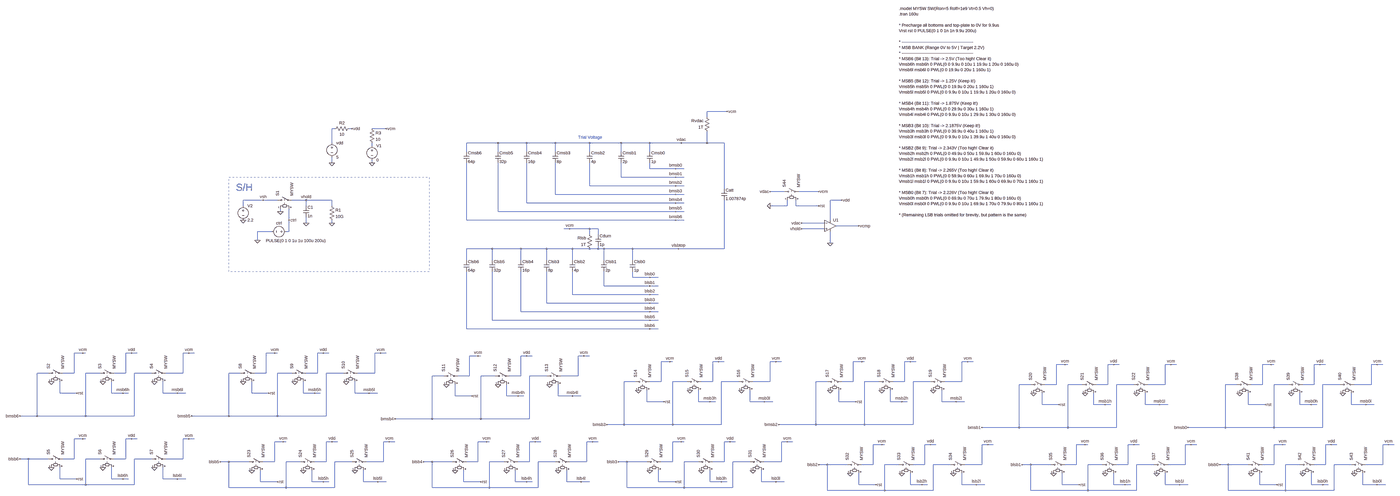
[diagram p0: schematic SAR_ADC_SIM.asc, whole sheet]
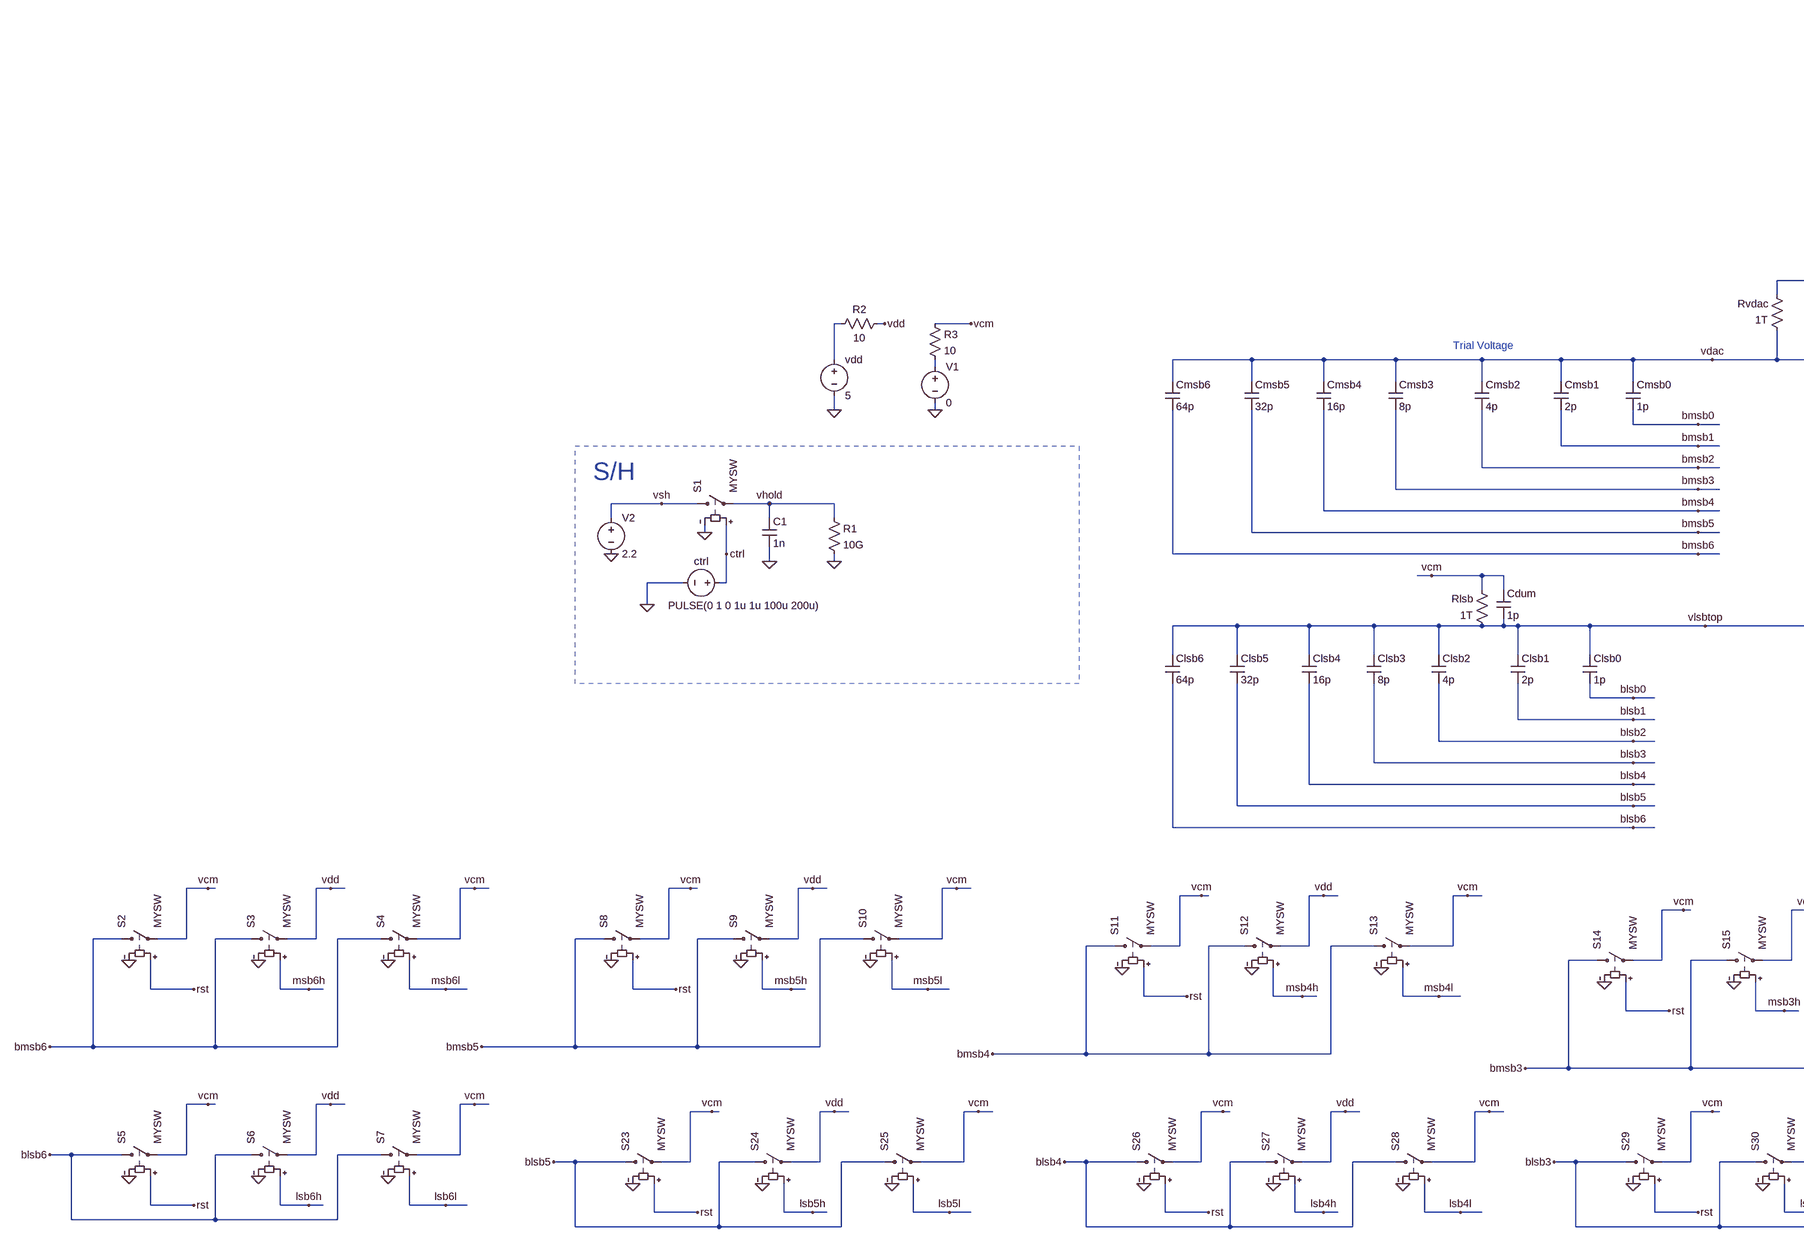
[diagram p1: schematic SAR_ADC_SIM.asc, part, row 1 of 1, column 1 of 2]
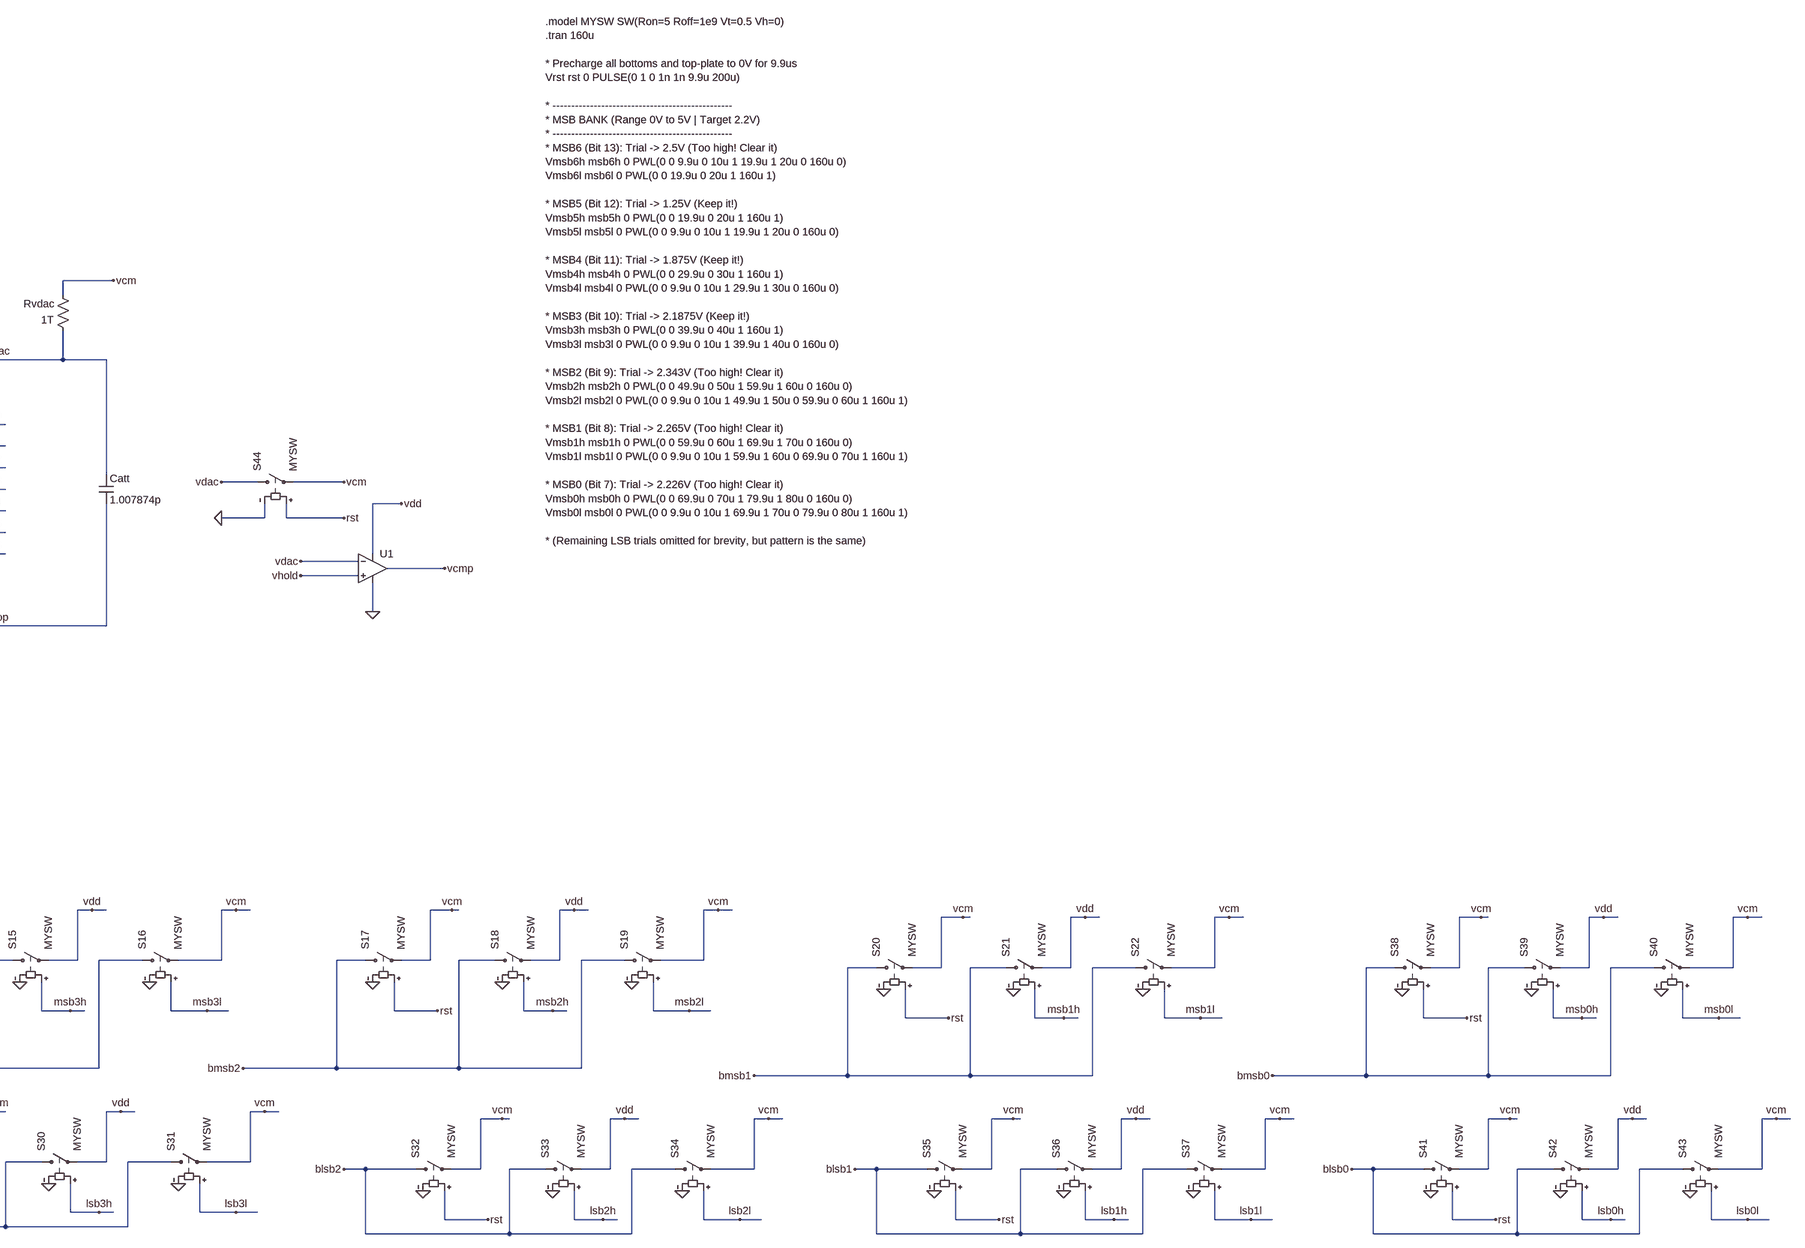
[diagram p2: schematic SAR_ADC_SIM.asc, part, row 1 of 1, column 2 of 2]
SAR_ADC_SIM.asc, the LTspice schematic file:
Version 4.1
SHEET 1 9780 2408
WIRE 2784 -16 2672 -16
WIRE 2672 16 2672 -16
WIRE 592 80 576 80
WIRE 688 80 672 80
WIRE 880 80 800 80
WIRE 576 160 576 80
WIRE 1504 160 1328 160
WIRE 1664 160 1504 160
WIRE 1824 160 1664 160
WIRE 2016 160 1824 160
WIRE 2192 160 2016 160
WIRE 2352 160 2192 160
WIRE 2528 160 2352 160
WIRE 2672 160 2672 96
WIRE 2672 160 2528 160
WIRE 2768 160 2672 160
WIRE 800 176 800 160
WIRE 1328 208 1328 160
WIRE 1504 208 1504 160
WIRE 1664 208 1664 160
WIRE 1824 208 1824 160
WIRE 2016 208 2016 160
WIRE 2192 208 2192 160
WIRE 2352 208 2352 160
WIRE 576 272 576 240
WIRE 800 272 800 256
WIRE 2352 304 2352 272
WIRE 2496 304 2352 304
WIRE 2544 304 2496 304
WIRE 2192 352 2192 272
WIRE 2496 352 2192 352
WIRE 2544 352 2496 352
WIRE 2016 400 2016 272
WIRE 2496 400 2016 400
WIRE 2544 400 2496 400
WIRE 2768 416 2768 160
WIRE 3104 432 3024 432
WIRE 3296 432 3184 432
WIRE 1824 448 1824 272
WIRE 2496 448 1824 448
WIRE 2544 448 2496 448
WIRE 192 480 80 480
WIRE 272 480 192 480
WIRE 432 480 352 480
WIRE 576 480 432 480
WIRE 3424 480 3360 480
WIRE 1664 496 1664 272
WIRE 2496 496 1664 496
WIRE 2544 496 2496 496
WIRE 80 512 80 480
WIRE 432 512 432 480
WIRE 576 512 576 480
WIRE 3120 512 3120 480
WIRE 3120 512 3024 512
WIRE 3168 512 3168 480
WIRE 3296 512 3168 512
WIRE 288 544 288 528
WIRE 1504 544 1504 272
WIRE 2496 544 1504 544
WIRE 2544 544 2496 544
WIRE 336 592 336 528
WIRE 1328 592 1328 272
WIRE 2496 592 1328 592
WIRE 2544 592 2496 592
WIRE 3360 592 3360 480
WIRE 432 608 432 576
WIRE 576 608 576 592
WIRE 3328 608 3200 608
WIRE 3520 624 3392 624
WIRE 1904 640 1872 640
WIRE 2016 640 1904 640
WIRE 2064 640 2016 640
WIRE 3328 640 3200 640
WIRE 240 656 160 656
WIRE 336 656 336 592
WIRE 336 656 320 656
WIRE 2016 672 2016 640
WIRE 2064 672 2064 640
WIRE 160 704 160 656
WIRE 3360 720 3360 656
WIRE 1472 752 1328 752
WIRE 1632 752 1472 752
WIRE 1776 752 1632 752
WIRE 1920 752 1776 752
WIRE 2016 752 1920 752
WIRE 2064 752 2064 736
WIRE 2064 752 2016 752
WIRE 2096 752 2064 752
WIRE 2256 752 2096 752
WIRE 2512 752 2256 752
WIRE 2768 752 2768 480
WIRE 2768 752 2512 752
WIRE 1328 816 1328 752
WIRE 1472 816 1472 752
WIRE 1632 816 1632 752
WIRE 1776 816 1776 752
WIRE 1920 816 1920 752
WIRE 2096 816 2096 752
WIRE 2256 816 2256 752
WIRE 2256 912 2256 880
WIRE 2352 912 2256 912
WIRE 2400 912 2352 912
WIRE 2096 960 2096 880
WIRE 2352 960 2096 960
WIRE 2400 960 2352 960
WIRE 1920 1008 1920 880
WIRE 2352 1008 1920 1008
WIRE 2400 1008 2352 1008
WIRE 1776 1056 1776 880
WIRE 2352 1056 1776 1056
WIRE 2400 1056 2352 1056
WIRE 1632 1104 1632 880
WIRE 2352 1104 1632 1104
WIRE 2400 1104 2352 1104
WIRE 1472 1152 1472 880
WIRE 2352 1152 1472 1152
WIRE 2400 1152 2352 1152
WIRE 1328 1200 1328 880
WIRE 2352 1200 1328 1200
WIRE 2400 1200 2352 1200
WIRE -816 1472 -864 1472
WIRE -800 1472 -816 1472
WIRE -544 1472 -576 1472
WIRE -512 1472 -544 1472
WIRE -224 1472 -256 1472
WIRE -192 1472 -224 1472
WIRE 256 1472 208 1472
WIRE 272 1472 256 1472
WIRE 528 1472 496 1472
WIRE 560 1472 528 1472
WIRE 848 1472 816 1472
WIRE 880 1472 848 1472
WIRE 1392 1488 1344 1488
WIRE 1408 1488 1392 1488
WIRE 1664 1488 1632 1488
WIRE 1696 1488 1664 1488
WIRE 1984 1488 1952 1488
WIRE 2016 1488 1984 1488
WIRE 2464 1520 2416 1520
WIRE 2480 1520 2464 1520
WIRE 2736 1520 2704 1520
WIRE 2768 1520 2736 1520
WIRE 3056 1520 3024 1520
WIRE 3088 1520 3056 1520
WIRE 3536 1520 3488 1520
WIRE 3552 1520 3536 1520
WIRE 3808 1520 3776 1520
WIRE 3840 1520 3808 1520
WIRE 4128 1520 4096 1520
WIRE 4160 1520 4128 1520
WIRE 4672 1536 4624 1536
WIRE 4688 1536 4672 1536
WIRE 4944 1536 4912 1536
WIRE 4976 1536 4944 1536
WIRE 5264 1536 5232 1536
WIRE 5296 1536 5264 1536
WIRE 5824 1536 5776 1536
WIRE 5840 1536 5824 1536
WIRE 6096 1536 6064 1536
WIRE 6128 1536 6096 1536
WIRE 6416 1536 6384 1536
WIRE 6448 1536 6416 1536
WIRE -1008 1584 -1072 1584
WIRE -864 1584 -864 1472
WIRE -864 1584 -928 1584
WIRE -720 1584 -800 1584
WIRE -576 1584 -576 1472
WIRE -576 1584 -640 1584
WIRE -432 1584 -528 1584
WIRE -256 1584 -256 1472
WIRE -256 1584 -352 1584
WIRE 64 1584 0 1584
WIRE 208 1584 208 1472
WIRE 208 1584 144 1584
WIRE 352 1584 272 1584
WIRE 496 1584 496 1472
WIRE 496 1584 432 1584
WIRE 640 1584 544 1584
WIRE 816 1584 816 1472
WIRE 816 1584 720 1584
WIRE 1200 1600 1136 1600
WIRE 1344 1600 1344 1488
WIRE 1344 1600 1280 1600
WIRE 1488 1600 1408 1600
WIRE 1632 1600 1632 1488
WIRE 1632 1600 1568 1600
WIRE 1776 1600 1680 1600
WIRE 1952 1600 1952 1488
WIRE 1952 1600 1856 1600
WIRE 2272 1632 2208 1632
WIRE 2416 1632 2416 1520
WIRE 2416 1632 2352 1632
WIRE 2560 1632 2480 1632
WIRE 2704 1632 2704 1520
WIRE 2704 1632 2640 1632
WIRE 2848 1632 2752 1632
WIRE 3024 1632 3024 1520
WIRE 3024 1632 2928 1632
WIRE 3344 1632 3280 1632
WIRE 3488 1632 3488 1520
WIRE 3488 1632 3424 1632
WIRE 3632 1632 3552 1632
WIRE 3776 1632 3776 1520
WIRE 3776 1632 3712 1632
WIRE 3920 1632 3824 1632
WIRE 4096 1632 4096 1520
WIRE 4096 1632 4000 1632
WIRE 4480 1648 4416 1648
WIRE 4624 1648 4624 1536
WIRE 4624 1648 4560 1648
WIRE 4768 1648 4688 1648
WIRE 4912 1648 4912 1536
WIRE 4912 1648 4848 1648
WIRE 5056 1648 4960 1648
WIRE 5232 1648 5232 1536
WIRE 5232 1648 5136 1648
WIRE 5632 1648 5568 1648
WIRE 5776 1648 5776 1536
WIRE 5776 1648 5712 1648
WIRE 5920 1648 5840 1648
WIRE 6064 1648 6064 1536
WIRE 6064 1648 6000 1648
WIRE 6208 1648 6112 1648
WIRE 6384 1648 6384 1536
WIRE 6384 1648 6288 1648
WIRE -944 1696 -944 1632
WIRE -848 1696 -944 1696
WIRE -656 1696 -656 1632
WIRE -592 1696 -656 1696
WIRE -560 1696 -592 1696
WIRE -368 1696 -368 1632
WIRE -288 1696 -368 1696
WIRE -240 1696 -288 1696
WIRE 128 1696 128 1632
WIRE 224 1696 128 1696
WIRE 416 1696 416 1632
WIRE 480 1696 416 1696
WIRE 512 1696 480 1696
WIRE 704 1696 704 1632
WIRE 784 1696 704 1696
WIRE 832 1696 784 1696
WIRE 1264 1712 1264 1648
WIRE 1360 1712 1264 1712
WIRE 1552 1712 1552 1648
WIRE 1616 1712 1552 1712
WIRE 1648 1712 1616 1712
WIRE 1840 1712 1840 1648
WIRE 1920 1712 1840 1712
WIRE 1968 1712 1920 1712
WIRE 2336 1744 2336 1680
WIRE 2432 1744 2336 1744
WIRE 2624 1744 2624 1680
WIRE 2688 1744 2624 1744
WIRE 2720 1744 2688 1744
WIRE 2912 1744 2912 1680
WIRE 2992 1744 2912 1744
WIRE 3040 1744 2992 1744
WIRE 3408 1744 3408 1680
WIRE 3504 1744 3408 1744
WIRE 3696 1744 3696 1680
WIRE 3760 1744 3696 1744
WIRE 3792 1744 3760 1744
WIRE 3984 1744 3984 1680
WIRE 4064 1744 3984 1744
WIRE 4112 1744 4064 1744
WIRE 4544 1760 4544 1696
WIRE 4640 1760 4544 1760
WIRE 4832 1760 4832 1696
WIRE 4896 1760 4832 1760
WIRE 4928 1760 4896 1760
WIRE 5120 1760 5120 1696
WIRE 5200 1760 5120 1760
WIRE 5248 1760 5200 1760
WIRE 5696 1760 5696 1696
WIRE 5792 1760 5696 1760
WIRE 5984 1760 5984 1696
WIRE 6048 1760 5984 1760
WIRE 6080 1760 6048 1760
WIRE 6272 1760 6272 1696
WIRE 6352 1760 6272 1760
WIRE 6400 1760 6352 1760
WIRE -1072 1824 -1072 1584
WIRE -1072 1824 -1168 1824
WIRE -800 1824 -800 1584
WIRE -800 1824 -1072 1824
WIRE -528 1824 -528 1584
WIRE -528 1824 -800 1824
WIRE 0 1824 0 1584
WIRE 0 1824 -208 1824
WIRE 272 1824 272 1584
WIRE 272 1824 0 1824
WIRE 544 1824 544 1584
WIRE 544 1824 272 1824
WIRE 1136 1840 1136 1600
WIRE 1136 1840 928 1840
WIRE 1408 1840 1408 1600
WIRE 1408 1840 1136 1840
WIRE 1680 1840 1680 1600
WIRE 1680 1840 1408 1840
WIRE 2208 1872 2208 1632
WIRE 2208 1872 2112 1872
WIRE 2480 1872 2480 1632
WIRE 2480 1872 2208 1872
WIRE 2752 1872 2752 1632
WIRE 2752 1872 2480 1872
WIRE 3280 1872 3280 1632
WIRE 3280 1872 3072 1872
WIRE 3552 1872 3552 1632
WIRE 3552 1872 3280 1872
WIRE 3824 1872 3824 1632
WIRE 3824 1872 3552 1872
WIRE 4416 1888 4416 1648
WIRE 4416 1888 4208 1888
WIRE 4688 1888 4688 1648
WIRE 4688 1888 4416 1888
WIRE 4960 1888 4960 1648
WIRE 4960 1888 4688 1888
WIRE 5568 1888 5568 1648
WIRE 5568 1888 5360 1888
WIRE 5840 1888 5840 1648
WIRE 5840 1888 5568 1888
WIRE 6112 1888 6112 1648
WIRE 6112 1888 5840 1888
WIRE -816 1952 -864 1952
WIRE -800 1952 -816 1952
WIRE -544 1952 -576 1952
WIRE -512 1952 -544 1952
WIRE -224 1952 -256 1952
WIRE -192 1952 -224 1952
WIRE 304 1968 256 1968
WIRE 320 1968 304 1968
WIRE 576 1968 544 1968
WIRE 608 1968 576 1968
WIRE 896 1968 864 1968
WIRE 928 1968 896 1968
WIRE 1440 1968 1392 1968
WIRE 1456 1968 1440 1968
WIRE 1712 1968 1680 1968
WIRE 1744 1968 1712 1968
WIRE 2032 1968 2000 1968
WIRE 2064 1968 2032 1968
WIRE 2528 1968 2480 1968
WIRE 2544 1968 2528 1968
WIRE 2800 1968 2768 1968
WIRE 2832 1968 2800 1968
WIRE 3120 1968 3088 1968
WIRE 3152 1968 3120 1968
WIRE 3648 1984 3600 1984
WIRE 3664 1984 3648 1984
WIRE 3920 1984 3888 1984
WIRE 3952 1984 3920 1984
WIRE 4240 1984 4208 1984
WIRE 4272 1984 4240 1984
WIRE 4784 1984 4736 1984
WIRE 4800 1984 4784 1984
WIRE 5056 1984 5024 1984
WIRE 5088 1984 5056 1984
WIRE 5376 1984 5344 1984
WIRE 5408 1984 5376 1984
WIRE 5888 1984 5840 1984
WIRE 5904 1984 5888 1984
WIRE 6160 1984 6128 1984
WIRE 6192 1984 6160 1984
WIRE 6480 1984 6448 1984
WIRE 6512 1984 6480 1984
WIRE -1120 2064 -1168 2064
WIRE -1008 2064 -1120 2064
WIRE -864 2064 -864 1952
WIRE -864 2064 -928 2064
WIRE -720 2064 -800 2064
WIRE -576 2064 -576 1952
WIRE -576 2064 -640 2064
WIRE -432 2064 -528 2064
WIRE -256 2064 -256 1952
WIRE -256 2064 -352 2064
WIRE 0 2080 -48 2080
WIRE 112 2080 0 2080
WIRE 256 2080 256 1968
WIRE 256 2080 192 2080
WIRE 400 2080 320 2080
WIRE 544 2080 544 1968
WIRE 544 2080 480 2080
WIRE 688 2080 592 2080
WIRE 864 2080 864 1968
WIRE 864 2080 768 2080
WIRE 1136 2080 1088 2080
WIRE 1248 2080 1136 2080
WIRE 1392 2080 1392 1968
WIRE 1392 2080 1328 2080
WIRE 1536 2080 1456 2080
WIRE 1680 2080 1680 1968
WIRE 1680 2080 1616 2080
WIRE 1824 2080 1728 2080
WIRE 2000 2080 2000 1968
WIRE 2000 2080 1904 2080
WIRE 2224 2080 2176 2080
WIRE 2336 2080 2224 2080
WIRE 2480 2080 2480 1968
WIRE 2480 2080 2416 2080
WIRE 2624 2080 2544 2080
WIRE 2768 2080 2768 1968
WIRE 2768 2080 2704 2080
WIRE 2912 2080 2816 2080
WIRE 3088 2080 3088 1968
WIRE 3088 2080 2992 2080
WIRE 3344 2096 3296 2096
WIRE 3456 2096 3344 2096
WIRE 3600 2096 3600 1984
WIRE 3600 2096 3536 2096
WIRE 3744 2096 3664 2096
WIRE 3888 2096 3888 1984
WIRE 3888 2096 3824 2096
WIRE 4032 2096 3936 2096
WIRE 4208 2096 4208 1984
WIRE 4208 2096 4112 2096
WIRE 4480 2096 4432 2096
WIRE 4592 2096 4480 2096
WIRE 4736 2096 4736 1984
WIRE 4736 2096 4672 2096
WIRE 4880 2096 4800 2096
WIRE 5024 2096 5024 1984
WIRE 5024 2096 4960 2096
WIRE 5168 2096 5072 2096
WIRE 5344 2096 5344 1984
WIRE 5344 2096 5248 2096
WIRE 5584 2096 5536 2096
WIRE 5696 2096 5584 2096
WIRE 5840 2096 5840 1984
WIRE 5840 2096 5776 2096
WIRE 5984 2096 5904 2096
WIRE 6128 2096 6128 1984
WIRE 6128 2096 6064 2096
WIRE 6272 2096 6176 2096
WIRE 6448 2096 6448 1984
WIRE 6448 2096 6352 2096
WIRE -944 2176 -944 2112
WIRE -848 2176 -944 2176
WIRE -656 2176 -656 2112
WIRE -592 2176 -656 2176
WIRE -560 2176 -592 2176
WIRE -368 2176 -368 2112
WIRE -288 2176 -368 2176
WIRE -240 2176 -288 2176
WIRE 176 2192 176 2128
WIRE 272 2192 176 2192
WIRE 464 2192 464 2128
WIRE 528 2192 464 2192
WIRE 560 2192 528 2192
WIRE 752 2192 752 2128
WIRE 832 2192 752 2192
WIRE 880 2192 832 2192
WIRE 1312 2192 1312 2128
WIRE 1408 2192 1312 2192
WIRE 1600 2192 1600 2128
WIRE 1664 2192 1600 2192
WIRE 1696 2192 1664 2192
WIRE 1888 2192 1888 2128
WIRE 1968 2192 1888 2192
WIRE 2016 2192 1968 2192
WIRE 2400 2192 2400 2128
WIRE 2496 2192 2400 2192
WIRE 2688 2192 2688 2128
WIRE 2752 2192 2688 2192
WIRE 2784 2192 2752 2192
WIRE 2976 2192 2976 2128
WIRE 3056 2192 2976 2192
WIRE 3104 2192 3056 2192
WIRE -1120 2208 -1120 2064
WIRE -800 2208 -800 2064
WIRE -800 2208 -1120 2208
WIRE -528 2208 -528 2064
WIRE -528 2208 -800 2208
WIRE 3520 2208 3520 2144
WIRE 3616 2208 3520 2208
WIRE 3808 2208 3808 2144
WIRE 3872 2208 3808 2208
WIRE 3904 2208 3872 2208
WIRE 4096 2208 4096 2144
WIRE 4176 2208 4096 2208
WIRE 4224 2208 4176 2208
WIRE 4656 2208 4656 2144
WIRE 4752 2208 4656 2208
WIRE 4944 2208 4944 2144
WIRE 5008 2208 4944 2208
WIRE 5040 2208 5008 2208
WIRE 5232 2208 5232 2144
WIRE 5312 2208 5232 2208
WIRE 5360 2208 5312 2208
WIRE 5760 2208 5760 2144
WIRE 5856 2208 5760 2208
WIRE 6048 2208 6048 2144
WIRE 6112 2208 6048 2208
WIRE 6144 2208 6112 2208
WIRE 6336 2208 6336 2144
WIRE 6416 2208 6336 2208
WIRE 6464 2208 6416 2208
WIRE 0 2224 0 2080
WIRE 320 2224 320 2080
WIRE 320 2224 0 2224
WIRE 592 2224 592 2080
WIRE 592 2224 320 2224
WIRE 1136 2224 1136 2080
WIRE 1456 2224 1456 2080
WIRE 1456 2224 1136 2224
WIRE 1728 2224 1728 2080
WIRE 1728 2224 1456 2224
WIRE 2224 2224 2224 2080
WIRE 2544 2224 2544 2080
WIRE 2544 2224 2224 2224
WIRE 2816 2224 2816 2080
WIRE 2816 2224 2544 2224
WIRE 3344 2240 3344 2096
WIRE 3664 2240 3664 2096
WIRE 3664 2240 3344 2240
WIRE 3936 2240 3936 2096
WIRE 3936 2240 3664 2240
WIRE 4480 2240 4480 2096
WIRE 4800 2240 4800 2096
WIRE 4800 2240 4480 2240
WIRE 5072 2240 5072 2096
WIRE 5072 2240 4800 2240
WIRE 5584 2240 5584 2096
WIRE 5904 2240 5904 2096
WIRE 5904 2240 5584 2240
WIRE 6176 2240 6176 2096
WIRE 6176 2240 5904 2240
FLAG 800 272 0
FLAG 432 608 0
FLAG 432 480 vhold
FLAG 576 608 0
FLAG 288 544 0
FLAG 160 704 0
FLAG 336 592 ctrl
FLAG 576 272 0
FLAG 688 80 vdd
FLAG 880 80 vcm
FLAG 2528 160 vdac
FLAG 2512 752 vlsbtop
FLAG 2784 -16 vcm
FLAG 1904 640 vcm
FLAG -992 1632 0
FLAG -704 1632 0
FLAG -416 1632 0
FLAG -592 1696 msb6h
FLAG -288 1696 msb6l
FLAG -816 1472 vcm
FLAG -544 1472 vdd
FLAG -992 2112 0
FLAG -704 2112 0
FLAG -416 2112 0
FLAG -592 2176 lsb6h
FLAG -288 2176 lsb6l
FLAG -816 1952 vcm
FLAG -544 1952 vdd
FLAG -1168 1824 bmsb6
FLAG -1168 2064 blsb6
FLAG -848 1696 rst
FLAG -848 2176 rst
FLAG 3360 720 0
FLAG 3200 640 vhold
FLAG 3200 608 vdac
FLAG 3424 480 vdd
FLAG 3520 624 vcmp
FLAG 80 592 0
FLAG 192 480 vsh
FLAG 80 1632 0
FLAG 368 1632 0
FLAG 656 1632 0
FLAG 480 1696 msb5h
FLAG 784 1696 msb5l
FLAG 256 1472 vcm
FLAG 528 1472 vdd
FLAG 224 1696 rst
FLAG -208 1824 bmsb5
FLAG 1216 1648 0
FLAG 1504 1648 0
FLAG 1792 1648 0
FLAG 1616 1712 msb4h
FLAG 1920 1712 msb4l
FLAG 1392 1488 vcm
FLAG 1664 1488 vdd
FLAG 1360 1712 rst
FLAG 928 1840 bmsb4
FLAG 2352 912 blsb0
FLAG 2352 960 blsb1
FLAG 2352 1008 blsb2
FLAG 2352 1056 blsb3
FLAG 2352 1104 blsb4
FLAG 2352 1152 blsb5
FLAG 2352 1200 blsb6
FLAG 2496 304 bmsb0
FLAG 2496 352 bmsb1
FLAG 2496 400 bmsb2
FLAG 2496 448 bmsb3
FLAG 2496 496 bmsb4
FLAG 2496 544 bmsb5
FLAG 2496 592 bmsb6
FLAG 2288 1680 0
FLAG 2576 1680 0
FLAG 2864 1680 0
FLAG 2688 1744 msb3h
FLAG 2992 1744 msb3l
FLAG 2464 1520 vcm
FLAG 2736 1520 vdd
FLAG 2112 1872 bmsb3
FLAG 2432 1744 rst
FLAG 3360 1680 0
FLAG 3648 1680 0
FLAG 3936 1680 0
FLAG 3760 1744 msb2h
FLAG 4064 1744 msb2l
FLAG 3536 1520 vcm
FLAG 3808 1520 vdd
FLAG 3504 1744 rst
FLAG 3072 1872 bmsb2
FLAG 4496 1696 0
FLAG 4784 1696 0
FLAG 5072 1696 0
FLAG 4896 1760 msb1h
FLAG 5200 1760 msb1l
FLAG 4672 1536 vcm
FLAG 4944 1536 vdd
FLAG 4640 1760 rst
FLAG 4208 1888 bmsb1
FLAG 128 2128 0
FLAG 416 2128 0
FLAG 704 2128 0
FLAG 528 2192 lsb5h
FLAG 832 2192 lsb5l
FLAG 304 1968 vcm
FLAG 576 1968 vdd
FLAG -48 2080 blsb5
FLAG 272 2192 rst
FLAG 1264 2128 0
FLAG 1552 2128 0
FLAG 1840 2128 0
FLAG 1664 2192 lsb4h
FLAG 1968 2192 lsb4l
FLAG 1440 1968 vcm
FLAG 1712 1968 vdd
FLAG 1088 2080 blsb4
FLAG 1408 2192 rst
FLAG 2352 2128 0
FLAG 2640 2128 0
FLAG 2928 2128 0
FLAG 2752 2192 lsb3h
FLAG 3056 2192 lsb3l
FLAG 2528 1968 vcm
FLAG 2800 1968 vdd
FLAG 2176 2080 blsb3
FLAG 2496 2192 rst
FLAG 3472 2144 0
FLAG 3760 2144 0
FLAG 4048 2144 0
FLAG 3872 2208 lsb2h
FLAG 4176 2208 lsb2l
FLAG 3648 1984 vcm
FLAG 3920 1984 vdd
FLAG 3296 2096 blsb2
FLAG 3616 2208 rst
FLAG 4608 2144 0
FLAG 4896 2144 0
FLAG 5184 2144 0
FLAG 5008 2208 lsb1h
FLAG 5312 2208 lsb1l
FLAG 4784 1984 vcm
FLAG 5056 1984 vdd
FLAG 4432 2096 blsb1
FLAG 4752 2208 rst
FLAG 5648 1696 0
FLAG 5936 1696 0
FLAG 6224 1696 0
FLAG 6048 1760 msb0h
FLAG 6352 1760 msb0l
FLAG 5824 1536 vcm
FLAG 6096 1536 vdd
FLAG 5792 1760 rst
FLAG 5360 1888 bmsb0
FLAG 5712 2144 0
FLAG 6000 2144 0
FLAG 6288 2144 0
FLAG 6112 2208 lsb0h
FLAG 6416 2208 lsb0l
FLAG 5888 1984 vcm
FLAG 6160 1984 vdd
FLAG 5536 2096 blsb0
FLAG 5856 2208 rst
FLAG -224 1472 vcm
FLAG 848 1472 vcm
FLAG 1984 1488 vcm
FLAG 3056 1520 vcm
FLAG 4128 1520 vcm
FLAG 5264 1536 vcm
FLAG 6416 1536 vcm
FLAG 6480 1984 vcm
FLAG 5376 1984 vcm
FLAG 3120 1968 vcm
FLAG 4240 1984 vcm
FLAG 2032 1968 vcm
FLAG 896 1968 vcm
FLAG -224 1952 vcm
FLAG 3024 432 vdac
FLAG 3296 432 vcm
FLAG 3296 512 rst
FLAG 3024 512 0
SYMBOL voltage 800 160 R0
WINDOW 123 0 0 Left 0
WINDOW 39 0 0 Left 0
SYMATTR InstName V1
SYMATTR Value 0
SYMBOL sw 256 480 R270
SYMATTR InstName S1
SYMATTR Value MYSW
SYMBOL cap 416 512 R0
SYMATTR InstName C1
SYMATTR Value 1n
SYMBOL res 560 496 R0
SYMATTR InstName R1
SYMATTR Value 10G
SYMBOL voltage 336 656 R90
WINDOW 0 -32 56 VBottom 2
WINDOW 3 35 -39 VTop 2
WINDOW 123 0 0 Left 0
WINDOW 39 0 0 Left 0
SYMATTR InstName ctrl
SYMATTR Value PULSE(0 1 0 1u 1u 100u 200u)
SYMBOL cap 2000 208 R0
SYMATTR InstName Cmsb2
SYMATTR Value 4p
SYMBOL cap 2176 208 R0
SYMATTR InstName Cmsb1
SYMATTR Value 2p
SYMBOL voltage 576 144 R0
SYMATTR InstName vdd
SYMATTR Value 5
SYMBOL cap 2336 208 R0
SYMATTR InstName Cmsb0
SYMATTR Value 1p
SYMBOL cap 1904 816 R0
SYMATTR InstName Clsb2
SYMATTR Value 4p
SYMBOL cap 2080 816 R0
SYMATTR InstName Clsb1
SYMATTR Value 2p
SYMBOL cap 2240 816 R0
SYMATTR InstName Clsb0
SYMATTR Value 1p
SYMBOL cap 2752 416 R0
SYMATTR InstName Catt
SYMATTR Value 1.007874p
SYMBOL res 2688 112 R180
WINDOW 0 36 76 Left 2
WINDOW 3 36 40 Left 2
SYMATTR InstName Rvdac
SYMATTR Value 1T
SYMBOL res 2032 768 R180
WINDOW 0 36 76 Left 2
WINDOW 3 36 40 Left 2
SYMATTR InstName Rlsb
SYMATTR Value 1T
SYMBOL sw -1024 1584 R270
SYMATTR InstName S2
SYMATTR Value MYSW
SYMBOL sw -736 1584 R270
SYMATTR InstName S3
SYMATTR Value MYSW
SYMBOL sw -448 1584 R270
SYMATTR InstName S4
SYMATTR Value MYSW
SYMBOL sw -1024 2064 R270
SYMATTR InstName S5
SYMATTR Value MYSW
SYMBOL sw -736 2064 R270
SYMATTR InstName S6
SYMATTR Value MYSW
SYMBOL sw -448 2064 R270
SYMATTR InstName S7
SYMATTR Value MYSW
SYMBOL OpAmps\\UniversalOpAmp2 3360 624 R0
SYMATTR InstName U1
SYMATTR Value2 Avol=1Meg GBW=100Meg Slew=10Meg
SYMATTR SpiceLine2 En=0 Enk=0 In=0 Ink=0 Rin=1e12
SYMBOL voltage 80 496 R0
SYMATTR InstName V2
SYMATTR Value 2.2
SYMBOL sw 48 1584 R270
SYMATTR InstName S8
SYMATTR Value MYSW
SYMBOL sw 336 1584 R270
SYMATTR InstName S9
SYMATTR Value MYSW
SYMBOL sw 624 1584 R270
SYMATTR InstName S10
SYMATTR Value MYSW
SYMBOL sw 1184 1600 R270
SYMATTR InstName S11
SYMATTR Value MYSW
SYMBOL sw 1472 1600 R270
SYMATTR InstName S12
SYMATTR Value MYSW
SYMBOL sw 1760 1600 R270
SYMATTR InstName S13
SYMATTR Value MYSW
SYMBOL cap 2048 672 R0
SYMATTR InstName Cdum
SYMATTR Value 1p
SYMBOL res 688 64 R90
WINDOW 0 0 56 VBottom 2
WINDOW 3 32 56 VTop 2
SYMATTR InstName R2
SYMATTR Value 10
SYMBOL res 784 64 R0
SYMATTR InstName R3
SYMATTR Value 10
SYMBOL cap 1808 208 R0
SYMATTR InstName Cmsb3
SYMATTR Value 8p
SYMBOL cap 1648 208 R0
SYMATTR InstName Cmsb4
SYMATTR Value 16p
SYMBOL cap 1488 208 R0
SYMATTR InstName Cmsb5
SYMATTR Value 32p
SYMBOL cap 1312 208 R0
SYMATTR InstName Cmsb6
SYMATTR Value 64p
SYMBOL cap 1760 816 R0
SYMATTR InstName Clsb3
SYMATTR Value 8p
SYMBOL cap 1616 816 R0
SYMATTR InstName Clsb4
SYMATTR Value 16p
SYMBOL cap 1456 816 R0
SYMATTR InstName Clsb5
SYMATTR Value 32p
SYMBOL cap 1312 816 R0
SYMATTR InstName Clsb6
SYMATTR Value 64p
SYMBOL sw 2256 1632 R270
SYMATTR InstName S14
SYMATTR Value MYSW
SYMBOL sw 2544 1632 R270
SYMATTR InstName S15
SYMATTR Value MYSW
SYMBOL sw 2832 1632 R270
SYMATTR InstName S16
SYMATTR Value MYSW
SYMBOL sw 3328 1632 R270
SYMATTR InstName S17
SYMATTR Value MYSW
SYMBOL sw 3616 1632 R270
SYMATTR InstName S18
SYMATTR Value MYSW
SYMBOL sw 3904 1632 R270
SYMATTR InstName S19
SYMATTR Value MYSW
SYMBOL sw 4464 1648 R270
SYMATTR InstName S20
SYMATTR Value MYSW
SYMBOL sw 4752 1648 R270
SYMATTR InstName S21
SYMATTR Value MYSW
SYMBOL sw 5040 1648 R270
SYMATTR InstName S22
SYMATTR Value MYSW
SYMBOL sw 96 2080 R270
SYMATTR InstName S23
SYMATTR Value MYSW
SYMBOL sw 384 2080 R270
SYMATTR InstName S24
SYMATTR Value MYSW
SYMBOL sw 672 2080 R270
SYMATTR InstName S25
SYMATTR Value MYSW
SYMBOL sw 1232 2080 R270
SYMATTR InstName S26
SYMATTR Value MYSW
SYMBOL sw 1520 2080 R270
SYMATTR InstName S27
SYMATTR Value MYSW
SYMBOL sw 1808 2080 R270
SYMATTR InstName S28
SYMATTR Value MYSW
SYMBOL sw 2320 2080 R270
SYMATTR InstName S29
SYMATTR Value MYSW
SYMBOL sw 2608 2080 R270
SYMATTR InstName S30
SYMATTR Value MYSW
SYMBOL sw 2896 2080 R270
SYMATTR InstName S31
SYMATTR Value MYSW
SYMBOL sw 3440 2096 R270
SYMATTR InstName S32
SYMATTR Value MYSW
SYMBOL sw 3728 2096 R270
SYMATTR InstName S33
SYMATTR Value MYSW
SYMBOL sw 4016 2096 R270
SYMATTR InstName S34
SYMATTR Value MYSW
SYMBOL sw 4576 2096 R270
SYMATTR InstName S35
SYMATTR Value MYSW
SYMBOL sw 4864 2096 R270
SYMATTR InstName S36
SYMATTR Value MYSW
SYMBOL sw 5152 2096 R270
SYMATTR InstName S37
SYMATTR Value MYSW
SYMBOL sw 5616 1648 R270
SYMATTR InstName S38
SYMATTR Value MYSW
SYMBOL sw 5904 1648 R270
SYMATTR InstName S39
SYMATTR Value MYSW
SYMBOL sw 6192 1648 R270
SYMATTR InstName S40
SYMATTR Value MYSW
SYMBOL sw 5680 2096 R270
SYMATTR InstName S41
SYMATTR Value MYSW
SYMBOL sw 5968 2096 R270
SYMATTR InstName S42
SYMATTR Value MYSW
SYMBOL sw 6256 2096 R270
SYMATTR InstName S43
SYMATTR Value MYSW
SYMBOL sw 3088 432 R270
SYMATTR InstName S44
SYMATTR Value MYSW
TEXT 40 408 Left 5 ;S/H
TEXT 1952 128 Left 2 ;Trial Voltage
TEXT 3744 -592 Left 2 !.model MYSW SW(Ron=5 Roff=1e9 Vt=0.5 Vh=0)\n.tran 160u\n \n* Precharge all bottoms and top-plate to 0V for 9.9us\nVrst rst 0 PULSE(0 1 0 1n 1n 9.9u 200u)\n \n* ------------------------------------------------\n* MSB BANK (Range 0V to 5V | Target 2.2V)\n* ------------------------------------------------\n* MSB6 (Bit 13): Trial -> 2.5V (Too high! Clear it)\nVmsb6h msb6h 0 PWL(0 0 9.9u 0 10u 1 19.9u 1 20u 0 160u 0)\nVmsb6l msb6l 0 PWL(0 0 19.9u 0 20u 1 160u 1)\n \n* MSB5 (Bit 12): Trial -> 1.25V (Keep it!)\nVmsb5h msb5h 0 PWL(0 0 19.9u 0 20u 1 160u 1)\nVmsb5l msb5l 0 PWL(0 0 9.9u 0 10u 1 19.9u 1 20u 0 160u 0)\n \n* MSB4 (Bit 11): Trial -> 1.875V (Keep it!)\nVmsb4h msb4h 0 PWL(0 0 29.9u 0 30u 1 160u 1)\nVmsb4l msb4l 0 PWL(0 0 9.9u 0 10u 1 29.9u 1 30u 0 160u 0)\n \n* MSB3 (Bit 10): Trial -> 2.1875V (Keep it!)\nVmsb3h msb3h 0 PWL(0 0 39.9u 0 40u 1 160u 1)\nVmsb3l msb3l 0 PWL(0 0 9.9u 0 10u 1 39.9u 1 40u 0 160u 0)\n \n* MSB2 (Bit 9): Trial -> 2.343V (Too high! Clear it)\nVmsb2h msb2h 0 PWL(0 0 49.9u 0 50u 1 59.9u 1 60u 0 160u 0)\nVmsb2l msb2l 0 PWL(0 0 9.9u 0 10u 1 49.9u 1 50u 0 59.9u 0 60u 1 160u 1)\n \n* MSB1 (Bit 8): Trial -> 2.265V (Too high! Clear it)\nVmsb1h msb1h 0 PWL(0 0 59.9u 0 60u 1 69.9u 1 70u 0 160u 0)\nVmsb1l msb1l 0 PWL(0 0 9.9u 0 10u 1 59.9u 1 60u 0 69.9u 0 70u 1 160u 1)\n \n* MSB0 (Bit 7): Trial -> 2.226V (Too high! Clear it)\nVmsb0h msb0h 0 PWL(0 0 69.9u 0 70u 1 79.9u 1 80u 0 160u 0)\nVmsb0l msb0l 0 PWL(0 0 9.9u 0 10u 1 69.9u 1 70u 0 79.9u 0 80u 1 160u 1)\n \n* (Remaining LSB trials omitted for brevity, but pattern is the same)
RECTANGLE Normal 1120 880 0 352 1

The netlist it stands for:
* SAR_ADC_SIM.asc
V1 N002 0 0
S1 vsh vhold ctrl 0 MYSW
C1 vhold 0 1n
R1 vhold 0 10G
V§ctrl ctrl 0 PULSE(0 1 0 1u 1u 100u 200u)
Cmsb2 vdac bmsb2 4p
Cmsb1 vdac bmsb1 2p
vdd N001 0 5
Cmsb0 vdac bmsb0 1p
Clsb2 vlsbtop blsb2 4p
Clsb1 vlsbtop blsb1 2p
Clsb0 vlsbtop blsb0 1p
Catt vdac vlsbtop 1.007874p
Rvdac vdac vcm 1T
Rlsb vlsbtop vcm 1T
S2 bmsb6 vcm rst 0 MYSW
S3 bmsb6 vdd msb6h 0 MYSW
S4 bmsb6 vcm msb6l 0 MYSW
S5 blsb6 vcm rst 0 MYSW
S6 blsb6 vdd lsb6h 0 MYSW
S7 blsb6 vcm lsb6l 0 MYSW
X§U1 vhold vdac vdd 0 vcmp level2 Avol=1Meg GBW=100Meg Slew=10Meg Ilimit=25m Rail=0 Vos=0 En=0 Enk=0 In=0 Ink=0 Rin=1e12  ; pins In+ In- V+ V- OUT
V2 vsh 0 2.2
S8 bmsb5 vcm rst 0 MYSW
S9 bmsb5 vdd msb5h 0 MYSW
S10 bmsb5 vcm msb5l 0 MYSW
S11 bmsb4 vcm rst 0 MYSW
S12 bmsb4 vdd msb4h 0 MYSW
S13 bmsb4 vcm msb4l 0 MYSW
Cdum vcm vlsbtop 1p
R2 vdd N001 10
R3 vcm N002 10
Cmsb3 vdac bmsb3 8p
Cmsb4 vdac bmsb4 16p
Cmsb5 vdac bmsb5 32p
Cmsb6 vdac bmsb6 64p
Clsb3 vlsbtop blsb3 8p
Clsb4 vlsbtop blsb4 16p
Clsb5 vlsbtop blsb5 32p
Clsb6 vlsbtop blsb6 64p
S14 bmsb3 vcm rst 0 MYSW
S15 bmsb3 vdd msb3h 0 MYSW
S16 bmsb3 vcm msb3l 0 MYSW
S17 bmsb2 vcm rst 0 MYSW
S18 bmsb2 vdd msb2h 0 MYSW
S19 bmsb2 vcm msb2l 0 MYSW
S20 bmsb1 vcm rst 0 MYSW
S21 bmsb1 vdd msb1h 0 MYSW
S22 bmsb1 vcm msb1l 0 MYSW
S23 blsb5 vcm rst 0 MYSW
S24 blsb5 vdd lsb5h 0 MYSW
S25 blsb5 vcm lsb5l 0 MYSW
S26 blsb4 vcm rst 0 MYSW
S27 blsb4 vdd lsb4h 0 MYSW
S28 blsb4 vcm lsb4l 0 MYSW
S29 blsb3 vcm rst 0 MYSW
S30 blsb3 vdd lsb3h 0 MYSW
S31 blsb3 vcm lsb3l 0 MYSW
S32 blsb2 vcm rst 0 MYSW
S33 blsb2 vdd lsb2h 0 MYSW
S34 blsb2 vcm lsb2l 0 MYSW
S35 blsb1 vcm rst 0 MYSW
S36 blsb1 vdd lsb1h 0 MYSW
S37 blsb1 vcm lsb1l 0 MYSW
S38 bmsb0 vcm rst 0 MYSW
S39 bmsb0 vdd msb0h 0 MYSW
S40 bmsb0 vcm msb0l 0 MYSW
S41 blsb0 vcm rst 0 MYSW
S42 blsb0 vdd lsb0h 0 MYSW
S43 blsb0 vcm lsb0l 0 MYSW
S44 vdac vcm rst 0 MYSW
* S/H
* Trial Voltage
.model MYSW SW(Ron=5 Roff=1e9 Vt=0.5 Vh=0)
.tran 160u
* Precharge all bottoms and top-plate to 0V for 9.9us
Vrst rst 0 PULSE(0 1 0 1n 1n 9.9u 200u)
* ------------------------------------------------
* MSB BANK (Range 0V to 5V | Target 2.2V)
* ------------------------------------------------
* MSB6 (Bit 13): Trial -> 2.5V (Too high! Clear it)
Vmsb6h msb6h 0 PWL(0 0 9.9u 0 10u 1 19.9u 1 20u 0 160u 0)
Vmsb6l msb6l 0 PWL(0 0 19.9u 0 20u 1 160u 1)
* MSB5 (Bit 12): Trial -> 1.25V (Keep it!)
Vmsb5h msb5h 0 PWL(0 0 19.9u 0 20u 1 160u 1)
Vmsb5l msb5l 0 PWL(0 0 9.9u 0 10u 1 19.9u 1 20u 0 160u 0)
* MSB4 (Bit 11): Trial -> 1.875V (Keep it!)
Vmsb4h msb4h 0 PWL(0 0 29.9u 0 30u 1 160u 1)
Vmsb4l msb4l 0 PWL(0 0 9.9u 0 10u 1 29.9u 1 30u 0 160u 0)
* MSB3 (Bit 10): Trial -> 2.1875V (Keep it!)
Vmsb3h msb3h 0 PWL(0 0 39.9u 0 40u 1 160u 1)
Vmsb3l msb3l 0 PWL(0 0 9.9u 0 10u 1 39.9u 1 40u 0 160u 0)
* MSB2 (Bit 9): Trial -> 2.343V (Too high! Clear it)
Vmsb2h msb2h 0 PWL(0 0 49.9u 0 50u 1 59.9u 1 60u 0 160u 0)
Vmsb2l msb2l 0 PWL(0 0 9.9u 0 10u 1 49.9u 1 50u 0 59.9u 0 60u 1 160u 1)
* MSB1 (Bit 8): Trial -> 2.265V (Too high! Clear it)
Vmsb1h msb1h 0 PWL(0 0 59.9u 0 60u 1 69.9u 1 70u 0 160u 0)
Vmsb1l msb1l 0 PWL(0 0 9.9u 0 10u 1 59.9u 1 60u 0 69.9u 0 70u 1 160u 1)
* MSB0 (Bit 7): Trial -> 2.226V (Too high! Clear it)
Vmsb0h msb0h 0 PWL(0 0 69.9u 0 70u 1 79.9u 1 80u 0 160u 0)
Vmsb0l msb0l 0 PWL(0 0 9.9u 0 10u 1 69.9u 1 70u 0 79.9u 0 80u 1 160u 1)
* (Remaining LSB trials omitted for brevity, but pattern is the same)
.lib UniversalOpAmp2.lib
.backanno
.end